# Altium project ReefingCutter_V5.PrjPcb
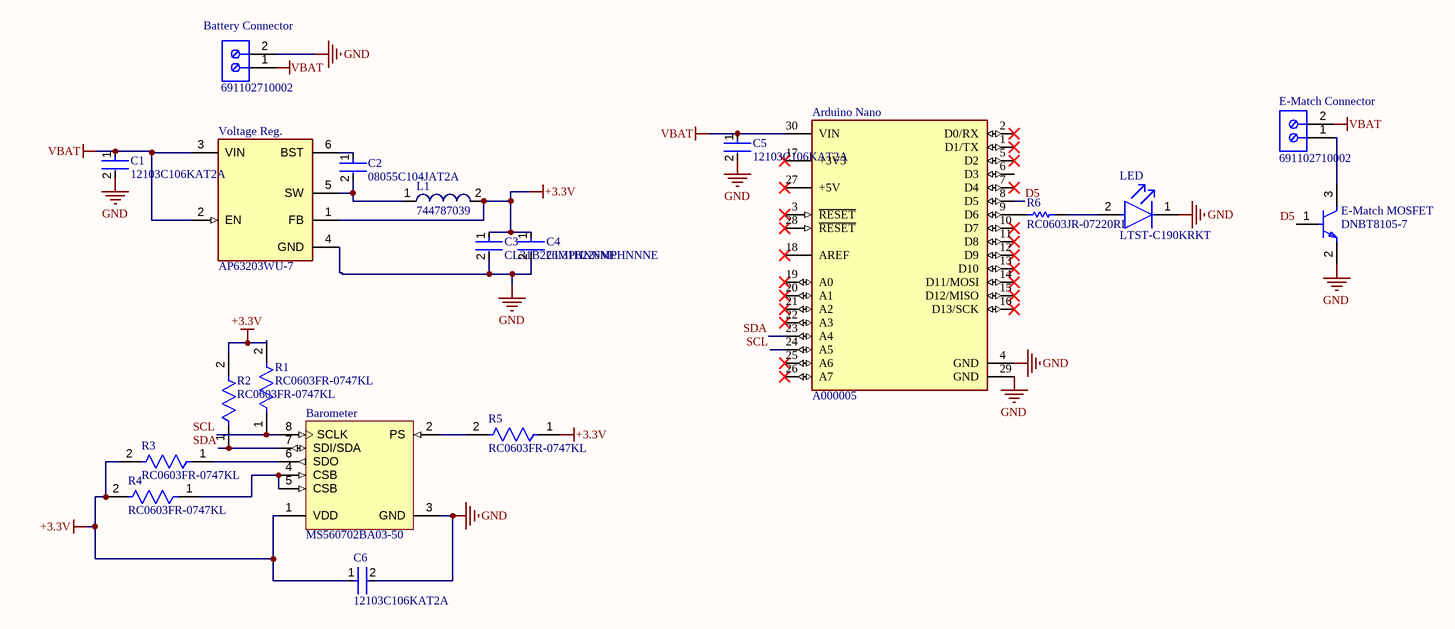
[diagram p0: ReefingCutterPCBV5Schematic.SchDoc]
CAGE_CODE: ?????; CONTRACT_NUMBER: <CONTRACT NO>; DOC_NO_ASSY_DWG: <ASSY DWG NO>; DOC_NO_BOM: <BOM DOC NO>; DOC_NO_FAB_DWG: <FAB DWG NO>; DOC_NO_SCH_DWG: <SCH DWG NO>; PCB_2_DEC_TOL: +/-.01; PCB_3_DEC_TOL: +/-.010; PCB_ANG_TOL: +/-1/2; PCB_ASSEMBLY_NO: <PCB ASSY NO>; PCB_CHECKER: - -----; PCB_CHECKER_APP_DATE: --/--/----; PCB_DESIGNER: - -----; PCB_DESIGNER_APP_DATE: --/--/----; PCB_DWG_NO: <PCB DWG NO>; PCB_ENGINEER: - -----; PCB_ENGINEER_APP_DATE: --/--/----; PCB_PART_NUMBER: <PCB PN>; PCB_REV: A; SCH_REV: A
1 sheet, 20 parts. Net scope: global (net labels, ports and power ports of the same name join across sheets).
Board file: ReefingCutterV5.PcbDoc

## Sheet ReefingCutterPCBV5Schematic.SchDoc
size 431 x 279 mm; SheetNumber: 1; SheetTotal: 1; ENG_APP_DATE: --/--/--; DSN_APP_DATE: --/--/--; CHK_APP_DATE: --/--/--

### Parts
Arduino_Nano  A000005  [FP-A000005-MFG]
Barometer  MS560702BA03-50  [TECO-MS560702BA03-50_V]
Battery_Connector  691102710002  [691102710002]
C1  12103C106KAT2A  [FP-1210-L_3_3_0_4-W_2_5_0-MFG]
C2  08055C104JAT2A  [FP-0805-L_2_01_0_2-W_1_25-MFG]
C3  CL31B226MPHNNNE  [FP-CL31-IPC_C]
C4  CL31B226MPHNNNE  [FP-CL31-IPC_C]
C5  12103C106KAT2A  [FP-1210-L_3_3_0_4-W_2_5_0-MFG]
C6  12103C106KAT2A  [FP-1210-L_3_3_0_4-W_2_5_0-MFG]
E-Match_Connector  691102710002  [691102710002]
E-Match_MOSFET  DNBT8105-7  [FP-SOT23-IPC_A]
L1  744787039  [WE-PD2SR 7850]
LED  LTST-C190KRKT  [FP-LTST-C190KRKT-MFG]
R1  RC0603FR-0747KL  [FP-RC0603FR-0747KL-MFG]
R2  RC0603FR-0747KL  [FP-RC0603FR-0747KL-MFG]
R3  RC0603FR-0747KL  [FP-RC0603FR-0747KL-MFG]
R4  RC0603FR-0747KL  [FP-RC0603FR-0747KL-MFG]
R5  RC0603FR-0747KL  [FP-RC0603FR-0747KL-MFG]
R6  RC0603JR-07220RL  [RESC1608X55X25LL10T15]
Voltage_Reg.  AP63203WU-7  [FP-TSOT26-MFG]

### Nets
+3.3V: Barometer.1(VDD) C3.1 C4.1 C6.1 L1.2 R1.2 R2.2 R3.2 R4.2 R5.1 Voltage_Reg..1(FB)
GND: Arduino_Nano.4(GND) Arduino_Nano.29(GND) Barometer.3(GND) Battery_Connector.2 C1.2 C3.2 C4.2 C5.2 C6.2 E-Match_MOSFET.2(E) LED.1(C) Voltage_Reg..4(GND)
VBAT: Arduino_Nano.30(VIN) Battery_Connector.1 C1.1 C5.1 E-Match_Connector.2 Voltage_Reg..2(EN) Voltage_Reg..3(VIN)
D5: Arduino_Nano.8(D5) E-Match_MOSFET.1(B)
SCL: Arduino_Nano.24(A5) Barometer.8(SCLK) R1.1
SDA: Arduino_Nano.23(A4) Barometer.7(SDI/SDA) R2.1
NetArduino_Nano_9: Arduino_Nano.9(D6) R6.1
NetBarometer_2: Barometer.2(PS) R5.2
NetBarometer_4: Barometer.4(CSB) Barometer.5(CSB) R4.1
NetBarometer_6: Barometer.6(SDO) R3.1
NetC2_1: C2.1 Voltage_Reg..6(BST)
NetC2_2: C2.2 L1.1 Voltage_Reg..5(SW)
NetE-Match_Connector_1: E-Match_Connector.1 E-Match_MOSFET.3(C)
NetLED_2: LED.2(A) R6.2

Not connected (* = marked no-connect by the designer): Arduino_Nano 1(D1/TX)* 2(D0/RX)* 3(~{RESET})* 5(D2)* 6(D3) 7(D4)* 10(D7)* 11(D8)* 12(D9)* 13(D10)* 14(D11/MOSI)* 15(D12/MISO)* 16(D13/SCK)* 17(+3V3)* 18(AREF)* 19(A0)* 20(A1)* 21(A2)* 22(A3)* 25(A6)* 26(A7)* 27(+5V)* 28(~{RESET})*

### Notes on the sheet
- DWG. NO.
- REV.
- SHT.
- THIS DOCUMENT AND THE DATA DISCLOSED HEREIN OR HEREWITH IS THE PROPERTY OF ALTIUM LIMITED AND MAY BE FREELY DISTRIBUTED IN WHOLE. NO RIGHTS ARE RESERVED OR EXPRESS OR IMPLIED WARANTEE GIVEN.
- REVISION
- DESCRIPTION
- DATE
- APPROVED
- ENG:
- APPROVALS
- PROJECT
- DSN:
- CHK:
- REFERENCE DOCUMENTS
- PROJECT REVISION:
- TITLE
- DOCUMENT REVISION:
- DESIGN ITEM:
- BOM:
- FAB DWG:
- PCB DWG:
- ASSY DWG:
- SCALE:
- SIZE
- B
- CAGE CODE
- FILE NAME
- DWG NO.
- SHEET
- OF
- REV

### Library data of the parts
Arduino_Nano = CMP-189986-000002-1: ARDUINO NANO ATMEGA328 EVAL BRD; Manufacturer: TDK; Manufacturer Part Number: C3216X6S2A106K160AC; Number of Bits: 8; Evaluation Kit: Yes; Operating Supply Voltage: 12V; Interface: I2C; Data Bus Width: 8b; Core Architecture: AVR; Packaging: Bulk; Length: 7inch; Package Quantity: 50; Width: 5inch; REACH SVHC: No SVHC; Weight: 0.358383oz; Series: AVR® ATmega; Height: 0.25inch; Supplier: Mouser; Supplier Part Number: 810-C3216X6S2A106K16; RoHS: Yes; Category: Ceramic Capacitors; Stock: 26512; Pricing: 1=1.33000, 10=1.05000, 50=1.05000, 100=0.78800, 500=0.59500, 1000=0.56600, 2000=0.56500, 4000=0.54500, 10000=0.51500 (USD)
Barometer = CMP-2000-07512-1: Barometric Pressure Sensor, with Stainless Steel Cap , 1.8 to 3.6 V, -40 to 85 degC, 8-Pin SMD, RoHS, Tape and Reel; Manufacturer: TE Connectivity; Lead Free: LeadFree; RoHSCompliant: false; Mounting Technology: SurfaceMount; Datasheet URL: http://www.te.com/commerce/DocumentDelivery/DDEController?Action=showdoc&DocId=Data+Sheet%7FMS5607-02BA03%7FB2%7Fpdf%7FEnglish%7FENG_DS_MS5607-02BA03_B2.pdf%7FMS560702BA03-50; Manufacturer URL: http://www.te.com/; Package Description: 8-Pin Surface Mount Device, Body 3 x 5 mm, Pitch 1.25 mm; Package Reference: MS560702BA03-50; Datasheet Version: 06/2017
Battery_Connector E-Match_Connector = CMP-1502-03258-1: Series 102 - 5.00 mm Horizontal Entry Modular with Pressure Clamp WR-TBL, 2 pin; Manufacturer: Wurth Elektronik; Pin Number: 2; Pitch: 5.00mm; Manufacturer URL: http://www.we-online.de; Mounting Technology: THT; Publisher: WurthElektronik; Packaging: Box; Package Reference: 691102710002; Datasheet URL: http://katalog.we-online.de/em/datasheet/6911027100xx.pdf; Operating Temperature: -40to105degC; Part Number: 691102710002
C1 C5 C6 = CMP-04427-000091-1: General Purpose Ceramic Capacitor, 1210, 10uF, 10%, X7R, 15%, 25V; Contact Plating: Tin; Lead Free: Lead Free; Height: 2.79mm; Length: 3.2mm; Capacitance: 10uF; REACH SVHC: No SVHC; Max Operating Temperature: 125°C; Tolerance: 10%; Thickness: 0.11inch; Voltage Rating (DC): 25V; Radiation Hardening: No; Packaging: Tape and Reel; Termination: SMD/SMT; Width: 0.098inch; Series: -; Package Quantity: 1; Construction: Flat; Mount: Surface Mount; Depth: 2.5mm; Min Operating Temperature: -55°C; RoHS Compliant: Yes; Case/Package: 1210; Dielectric: X7R; Voltage Rating: 25V; Case Code (Imperial): 1210; Voltage: 25V; Case Code (Metric): 3225
C2 = CMP-2000-05808-2: General Purpose Ceramic Capacitor, 0805, 100nF, 5%, X7R, 0.15, 50V; Dissipation Factor: 2.5%; Insulation Resistance: 100GR; Length: 2.01mm; Min Operating Temperature: -55°C; Number of Pins: 2; Width: 0.049inch; Height: 0.94mm; Max Operating Temperature: 125°C; RoHS Compliant: Yes; Depth: 1.25mm; Radiation Hardening: No; Case Code (Metric): 2012; Case/Package: 0805; Contact Plating: Tin; Mount: Surface Mount; Tolerance: 5%; Dielectric Material: Ceramic; Case Code (Imperial): 0805; Capacitance: 100nF; Dielectric: X7R; Voltage Rating: 50V; REACH SVHC: No SVHC; Thickness: 0.037inch; Voltage Rating (DC): 50V; Lead Free: Lead Free; Package Quantity: 1; Packaging: Tape and Reel; Voltage: 50V; Termination: SMD/SMT
C3 C4 = CMP-13271-004071-1: Cap Ceramic 22uF 10V X7R ±20% SMD 1206 +125°C Embossed T/R; Min Operating Temperature: -55°C; Tolerance: 20%; Case Code (Metric): 3216; Width: 0.063inch; Packaging: Tape and Reel; Thickness: 0.071inch; Max Operating Temperature: 125°C; Voltage Rating: 10V; Case Code (Imperial): 1206; Voltage Rating (DC): 10V; Capacitance: 22uF; Mount: Surface Mount; Length: 0.126inch; Case/Package: 1206; Lead Free: Lead Free; Package Quantity: 1
E-Match_MOSFET = CMP-12798-000033-1: TRANS NPN 60V 1A SOT23-3; hFE Min: 30; Gain Bandwidth Product: 150MHz; Number of Elements: 1; Max Power Dissipation: 600mW; Collector Base Voltage (VCBO): 80V; Power Dissipation: 300mW; Element Configuration: Single; Collector Emitter Saturation Voltage: 500mV; Emitter Base Voltage (VEBO): 5V; Collector Emitter Breakdown Voltage: 60V; Weight: 0.000282oz; Contact Plating: Tin; Collector Emitter Voltage (VCEO): 60V; Packaging: Tape and Reel; Number of Pins: 3; Max Operating Temperature: 150°C; Width: 1.3mm; Length: 2.9mm; Transition Frequency: 150MHz; Radiation Hardening: No; Case/Package: SOT-23; Number of Terminals: 3; REACH SVHC: No SVHC; Max Breakdown Voltage: 60V; Mount: Surface Mount; Polarity: NPN; Current Rating: 1A; Frequency: 150MHz; Min Operating Temperature: -55°C; Max Collector Current: 1A; Lead Free: Lead Free; Package Quantity: 3000; Voltage Rating (DC): 60V; Height: 1mm
L1 = CMP-1397-00011-1: Shielded Power Inductor WE-PD2SR, L=3.9 µH; Manufacturer: Wuerth Elektronik; Inductance: 3.9 ÂµH; ComponentLink1URL: http://www.we-online.com; PackageReference: WE-PD2SR 7850; ComponentLink1Description: Manufacturer URL; PartNumber: 744787039; ComponentLink2URL: http://www.we-online.de/katalog/media/pdf/744787039.pdf; ComponentLink2Description: Datasheet
LED = CMP-1674-00011-2: LED RED CLEAR CHIP SMD; Reverse Voltage: 5V; Viewing Angle: 130°; Power Rating: 75mW; Test Current: 20mA; Number of Elements: 1; Lens Color: Colorless; Wavelength: 639nm; Dominant Wavelength: 631nm; Lens Style: Diffused; Forward Current: 30mA; Forward Voltage: 2.4V; Luminous Intensity: 54mcd; Color: Red; Case Code (Imperial): 0603; Lens Transparency: Clear; Lead Free: Lead Free; Package Quantity: 1; Packaging: Tape and Reel; Max Operating Temperature: 85°C; Number of Pins: 2; Height: 0.8mm; Case/Package: 0603; Number of LEDs: 1; Width: 0.8mm; Case Code (Metric): 1608; Depth: 0.8mm; Mount: Surface Mount; Radiation Hardening: No; Length: 1.6mm; Illumination Color: Red; Power Dissipation: 75mW; Min Operating Temperature: -55°C
R1-R5 = CMP-1659-00055-2: RES SMD 47K OHM 1% 1/10W 0603; Voltage Rating: 50V; Temperature Coefficient: 100ppm/°C; Max Power Dissipation: 100mW; Resistance: 47kR; Voltage Rating (DC): 50V; Min Operating Temperature: -55°C; Packaging: Tape and Reel; Features: Moisture Resistant; Termination: SMD/SMT; Technology: THICK FILM; Lead Free: Lead Free; Max Operating Temperature: 155°C; Width: 0.031inch; Case Code (Metric): 1608; Tolerance: 1%; Package Quantity: 1; Resistor Type: Thick Film; RoHS Compliant: Yes; Case/Package: 0603; Case Code (Imperial): 0603; Resistance Tolerance: 1%; Length: 0.063inch; Series: RC; Number of Pins: 2; Power Rating: 100mW; Number of Terminations: 2; Construction: Rectangular; Height: 0.022inch; Military Standard: Not; Size Code: 0603; Depth: 0.8mm
R6 = CMP-1012-00058-2: Chip Resistor, 220 Ohm, +/- 5%, 0.1 W, -55 to 155 degC, 0603 (1608 Metric), RoHS, Tape and Reel; Manufacturer: Yageo; Temperature Coefficient: 100PPM/C; Voltage Rating: 50V; Resistance: 220Ohms; Power Rating: 100mW; Mounting Technology: SurfaceMount; Tolerance: 5%; Datasheet URL: http://www.yageo.com/documents/recent/PYu-RC_Group_51_RoHS_L_7.pdf; Operating Temperature Range: -55Cto+155C; Packaging: Reel; Package Description: 2-Pin Surface Mount Device, Body 1.6 x 0.8 mm; Termination Style: SMD/SMT; Datasheet Version: Rev. 7, 05/2017; Product: ThickFilmResistorsGeneralPurpose; Package Reference: 0603; Case Code - in: 0603; Manufacturer URL: http://www.yageo.com/; Case Code - mm: 1608; Series: RC
Voltage_Reg. = CMP-12757-000006-1: IC REG BUCK 3.3V 2A TSOT26; Manufacturer: Diodes Inc.; Output Type: Fixed; Min Supply Voltage: 3.8V; Number Of Outputs: 1; Max Junction Temp: +160°C; Nominal Supply Current: 22uA; Standoff Height: 0.01mm; Switching Frequency: 1.1MHz; Max Supply Voltage: 32V; ComponentLink2Description: Datasheet; Device Class L1: Integrated Circuits (ICs); Temperature: to +160°C; Device Class L3: Voltage Regulators - Switching; RoHS: TRUE; Octopart: https://octopart.com/ap63203wu-7-diodes+inc.-98099550; Output Voltage: 3.3V; Lead Free: Yes; ComponentLink2URL: https://www.diodes.com/assets/Datasheets/AP63200-AP63201-AP63203-AP63205.pdf; Digikey Description: IC REG BUCK 3.3V 2A TSOT26; Footprint Url: https://www.diodes.com/assets/Package-Files/TSOT26.pdf; Ambient Temperature Range High: +85°C; Height: 1mm; Automotive: No; Temperature Range High: +160°C; Switching Topology: Buck; Output Current: 2A; Package: TSOT26; Category: IC; Mouser Description: AP63203 Series 3.3 V 2 A SMT Fixed Low IQ Synchronous Buck - TSOT-26; Device Class L2: Power Management ICs; Ambient Temperature Range Low: -40°C; Manufacturer Part Number: AP63203WU-7